# EAGLE schematic triac (EAGLE 6.1)
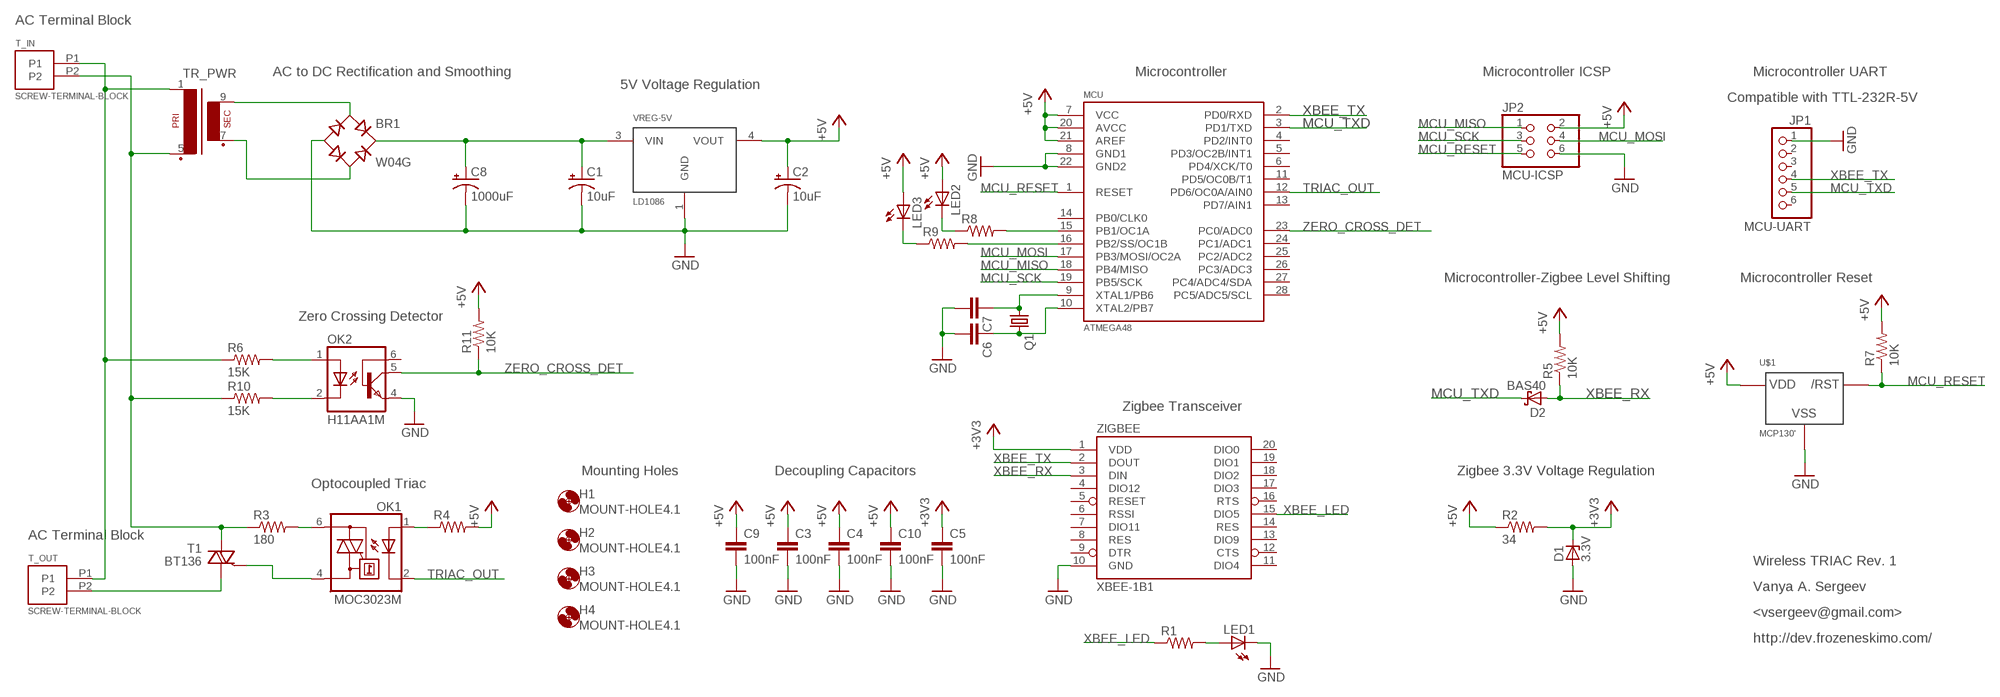
[diagram p0: schematic, sheet 1]

## Parts
BR1  W04G  [WOG]
C1  10uF  CPOL-USE2.5-5  [E2,5-5]
C2  10uF  CPOL-USE2.5-5  [E2,5-5]
C3  100nF  C-EUC0805  [C0805]
C4  100nF  C-EUC0805  [C0805]
C5  100nF  C-EUC0805  [C0805]
C6  C-EUC0805  [C0805]
C7  C-EUC0805  [C0805]
C8  1000uF  CPOL-USE5-13  [E5-13]
C9  100nF  C-EUC0805  [C0805]
C10  100nF  C-EUC0805  [C0805]
D1  3.3V  ZENER-DIODESOT23  [SOT23]
D2  BAS40  [SOT23]
H1  MOUNT-HOLE4.1  [4,1]
H2  MOUNT-HOLE4.1  [4,1]
H3  MOUNT-HOLE4.1  [4,1]
H4  MOUNT-HOLE4.1  [4,1]
JP1  MCU-UART  PINHD-1X6  [1X06]
JP2  MCU-ICSP  PINHD-2X3  [2X03]
LED1  LEDCHIPLED_0805  [CHIPLED_0805]
LED2  LEDCHIPLED_0805  [CHIPLED_0805]
LED3  LEDCHIPLED_0805  [CHIPLED_0805]
MCU  ATMEGA48  [DIL28-3]
OK1  MOC3023M  [DIL06]
OK2  H11AA1M  H11A1M  [DIL06]
Q1  CRYSTALHC49UP  [HC49UP]
R1  R-US_R0805  [R0805]
R2  34  R-US_R0805  [R0805]
R3  180  R-US_0204/7  [0204/7]
R4  R-US_R0805  [R0805]
R5  10K  R-US_R0805  [R0805]
R6  15K  R-US_0204/7  [0204/7]
R7  10K  R-US_R0805  [R0805]
R8  R-US_R0805  [R0805]
R9  R-US_R0805  [R0805]
R10  15K  R-US_0204/7  [0204/7]
R11  10K  R-US_R0805  [R0805]
T1  BT136  [TO220AB]
T_IN  SCREW-TERMINAL-BLOCK  [TERMINAL-BLOCK]
T_OUT  SCREW-TERMINAL-BLOCK  [TERMINAL-BLOCK]
TR_PWR  EI30-1  [EI30-1]
U$1  MCP130'  [TO92]
VREG-5V  LD1086  [DPACK]
ZIGBEE  XBEE-1B1  [XBEE-1]

## Nets
+3V3: C5.1 D1.3(C) R2.2 ZIGBEE.1(VDD)
+5V: C2.+ C3.1 C4.1 C9.1 C10.1 JP2.2 LED2.A LED3.A MCU.7(VCC) MCU.20(AVCC) MCU.21(AREF) R2.1 R4.2 R5.2 R7.2 R11.2 U$1.2(VDD) VREG-5V.4(VOUT)
DC+: BR1.+ C1.+ C8.+ VREG-5V.3(VIN)
GND: BR1.- C1.- C2.- C3.2 C4.2 C5.2 C6.2 C7.2 C8.- C9.2 C10.2 D1.1(A) JP1.1 JP2.6 LED1.C MCU.8(GND1) MCU.22(GND2) OK2.4(EMI) U$1.3(VSS) VREG-5V.1(GND) ZIGBEE.10(GND)
MCU_MISO: JP2.1 MCU.18(PB4/MISO)
MCU_MOSI: JP2.4 MCU.17(PB3/MOSI/OC2A)
MCU_RESET: JP2.5 MCU.1(RESET) R7.1 U$1.1(/RST)
MCU_SCK: JP2.3 MCU.19(PB5/SCK)
MCU_TXD: D2.3(C) JP1.5 MCU.3(PD1/TXD)
N$1: OK1.6(A2) R3.2
N$2: BR1.AC1 TR_PWR.9(S4)
N$3: BR1.AC2 TR_PWR.7(S3)
N$4: C6.1 MCU.10(XTAL2/PB7) Q1.2
N$5: T1.1(A1) T_OUT.P2
N$6: OK1.4(A1) T1.3(G)
N$7: OK1.1(A) R4.1
N$8: OK2.2(C) R10.2
N$9: OK2.1(A) R6.2
N$11: LED1.A R1.2
N$13: LED2.C R8.1
N$14: MCU.15(PB1/OC1A) R8.2
N$15: C7.1 MCU.9(XTAL1/PB6) Q1.1
N$16: MCU.16(PB2/SS/OC1B) R9.2
N$17: LED3.C R9.1
N$18: R6.1 T_IN.P1 T_OUT.P1 TR_PWR.1
N$20: R3.1 R10.1 T1.2(A2) T_IN.P2 TR_PWR.5(P2)
TRIAC_OUT: MCU.12(PD6/OC0A/AIN0) OK1.2(C)
XBEE_LED: R1.1 ZIGBEE.15(DIO5)
XBEE_RX: D2.1(A) R5.1 ZIGBEE.3(DIN)
XBEE_TX: JP1.4 MCU.2(PD0/RXD) ZIGBEE.2(DOUT)
ZERO_CROSS_DET: MCU.23(PC0/ADC0) OK2.5(COL) R11.1
Unconnected: JP1.2 JP1.3 JP1.6 MCU.4(PD2/INT0) MCU.5(PD3/OC2B/INT1) MCU.6(PD4/XCK/T0) MCU.11(PD5/OC0B/T1) MCU.13(PD7/AIN1) MCU.14(PB0/CLK0) MCU.24(PC1/ADC1) MCU.25(PC2/ADC2) MCU.26(PC3/ADC3) MCU.27(PC4/ADC4/SDA) MCU.28(PC5/ADC5/SCL) OK2.6(BAS) ZIGBEE.4(DIO12) ZIGBEE.5(RESET) ZIGBEE.6(RSSI) ZIGBEE.7(DIO11) ZIGBEE.8(RES) ZIGBEE.9(DTR) ZIGBEE.11(DIO4) ZIGBEE.12(CTS) ZIGBEE.13(DIO9) ZIGBEE.14(RES) ZIGBEE.16(RTS) ZIGBEE.17(DIO3) ZIGBEE.18(DIO2) ZIGBEE.19(DIO1) ZIGBEE.20(DIO0)

## Notes on the sheet
- AC Terminal Block
- AC to DC Rectification and Smoothing | Microcontroller | Microcontroller ICSP | Microcontroller UART
- 5V Voltage Regulation
- Compatible with TTL-232R-5V
- Microcontroller-Zigbee Level Shifting | Microcontroller Reset
- Zero Crossing Detector
- Zigbee Transceiver
- Mounting Holes | Decoupling Capacitors | Zigbee 3.3V Voltage Regulation
- Optocoupled Triac
- AC Terminal Block
- Wireless TRIAC Rev. 1
- Vanya A. Sergeev
- <vsergeev@gmail.com>
- http://dev.frozeneskimo.com/

## Library data of the parts
BR1 = dbridge:W*G: Vishay/General Semiconductor W005G - W10G Bridge rectifier, 1.5A, 50 to 1000V
C1 C2 C8 = rcl:CPOL-US: POLARIZED CAPACITOR, American symbol
C3-C7 C9 C10 = rcl:C-EU: CAPACITOR, European symbol
D1 = diode:ZENER-DIODE: Z-Diode
D2 = diode:BAS40: Silicon Schottky Diodes General-purpose diode for high-speed switching
H1-H4 = holes:MOUNT-HOLE: MOUNTING HOLE with drill center marker
JP1 = pinhead:PINHD-1X6: PIN HEADER
JP2 = pinhead:PINHD-2X3: PIN HEADER
LED1-LED3 = led:LED: LED OSRAM: - CHIPLED LG R971, LG N971, LY N971, LG Q971, LY Q971, LO R971, LY R971 LH N974, LH R974 LS Q976, LO Q976, LY Q976 LO Q996 - Hyper CHIPLED LW Q18S LB Q993, LB Q99A, LB R99A - SideLED LS A670, LO A670, LY A670, LG A670, LP A670 LB A673, LV A673, LT A673, LW A673 LH A674 LY A675 LS A676, LA A676, LO A676, LY A676, LW A676 LS A679, LY A679, LG A679 - Hyper Micro SIDELED® LS Y876, LA Y876, LO Y876, LY Y876 LT Y87S - SmartLED LW L88C, LW L88S LB L89C, LB L89S, LG L890 LS L89K, LO L89K, LY L89K LS L896, LA L896, LO L896, LY L896 - TOPLED LS T670, LO T670, LY T670, LG T670, LP T670 LSG T670, LSP T670, LSY T670, LOP T670, LYG T670 LG T671, LOG T671, LSG T671 LB T673, LV T673, LT T673, LW T673 LH T674 LS T676, LA T676, LO T676, LY T676, LB T676, LH T676, LSB T676, LW T676 LB T67C, LV T67C, LT T67C, LS T67K, LO T67K, LY T67K, LW E67C LS E67B, LA E67B, LO E67B, LY E67B, LB E67C, LV E67C, LT E67C LW T67C LS T679, LY T679, LG T679 LS T770, LO T770, LY T770, LG T770, LP T770 LB T773, LV T773, LT T773, LW T773 LH T774 LS E675, LA E675, LY E675, LS T675 LS T776, LA T776, LO T776, LY T776, LB T776 LHGB T686 LT T68C, LB T68C - Hyper Mini TOPLED® LB M676 - Mini TOPLED Santana® LG M470 LS M47K, LO M47K, LY M47K Source: http://www.osram.convergy.de LUXEON: - LUMILED® LXK2-PW12-R00, LXK2-PW12-S00, LXK2-PW14-U00, LXK2-PW14-V00 LXK2-PM12-R00, LXK2-PM12-S00, LXK2-PM14-U00 LXK2-PE12-Q00, LXK2-PE12-R00, LXK2-PE12-S00, LXK2-PE14-T00, LXK2-PE14-U00 LXK2-PB12-K00, LXK2-PB12-L00, LXK2-PB12-M00, LXK2-PB14-N00, LXK2-PB14-P00, LXK2-PB14-Q00 LXK2-PR12-L00, LXK2-PR12-M00, LXK2-PR14-Q00, LXK2-PR14-R00 LXK2-PD12-Q00, LXK2-PD12-R00, LXK2-PD12-S00 LXK2-PH12-R00, LXK2-PH12-S00 LXK2-PL12-P00, LXK2-PL12-Q00, LXK2-PL12-R00 Source: www.luxeon.com KINGBRIGHT: KA-3528ASYC Source: www.kingbright.com
MCU = atmel-newmicros:ATMEGA48
OK1 = optocoupler:MOC30*M: RANDOM-PHASE OPTOISOLATORS TRIAC DRIVER OUTPUT Source: http://www.fairchildsemi.com MOC3020-M.pdf
OK2 = optocoupler:H11A*?M: General Purpose 6-Pin Phototransistor Optocouplers Source: http://www.fairchildsemi.com/ds/4N/4N35-M.pdf
Q1 = crystal:CRYSTAL: CRYSTAL
R1-R11 = rcl:R-US_: RESISTOR, American symbol
T1 = triac:BT136: Triac BT136 series E sensitive gate Source: http://www.nxp.com/acrobat_download/datasheets/BT136_SERIES_E_2.pdf
T_IN T_OUT = custom-screw-terminal:SCREW-TERMINAL-BLOCK
TR_PWR = trafo:EI30-1: TRANSFORMER 1 primary winding, 1 secondary winding ERA
U$1 = custom-reset-supervisor:MCP130
VREG-5V = st-vregs:LD1086
ZIGBEE = SparkFun:XBEE-1